# EAGLE schematic 612_jetracer (EAGLE 9.2.2)
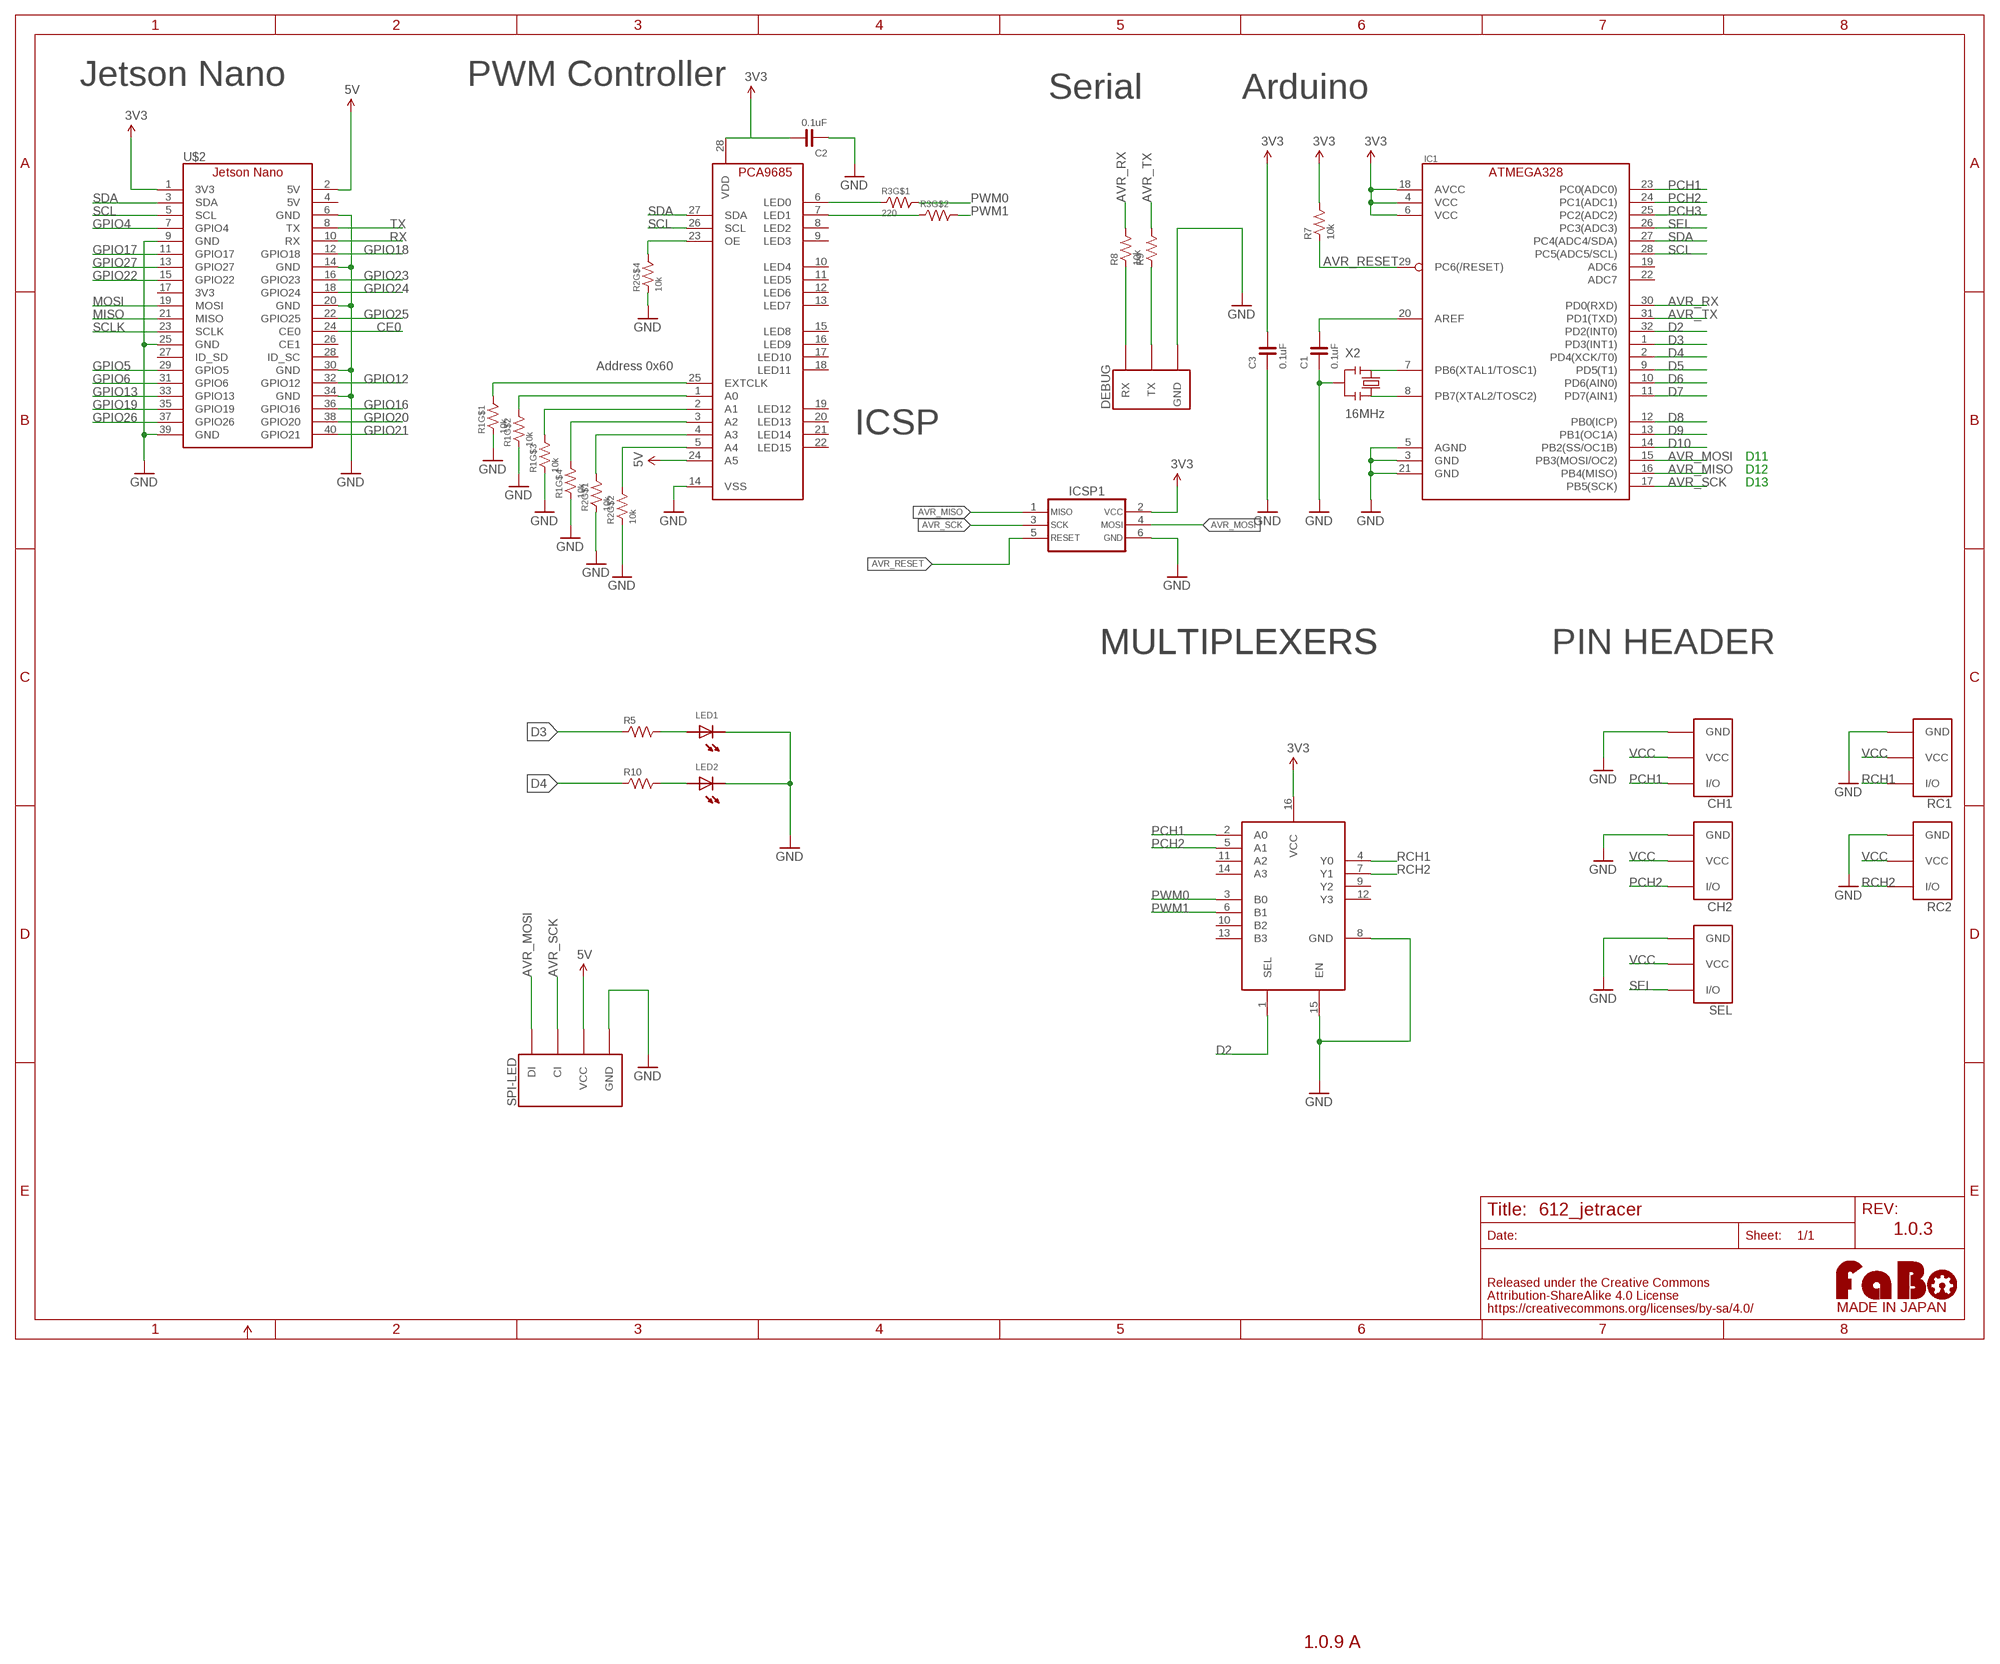
[diagram p0: schematic, sheet 1]

## Parts
C1  0.1uF  CAPACITOR-0603  [0603]
C2  0.1uF  CAPACITOR-0603  [0603]
C3  0.1uF  CAPACITOR-0603  [0603]
CH1  FABO_BRICK_3PIN-HEADER  [FABO_BRICK_3PIN_HEADER]
CH2  FABO_BRICK_3PIN-HEADER  [FABO_BRICK_3PIN_HEADER]
DEBUG  FABO_BRICK_3PIN_DEBUG  [FABO_BRICK_3PIN_DEBUG]
IC1  ATMEGA328P-AU  [TQFP-32]
IC3  MULTIPLEXERSMC74HC157A  [TSSOP-16]
ICSP1  ICSP_AVR-TC_NOHOLE  [TC2030]
LED1  LED-0603  [0603]
LED2  LED-0603  [0603]
R1  10k  RESISTOR_ARRAY  [EXBV8V]
R2  10k  RESISTOR_ARRAY  [EXBV8V]
R3  220  RESISTOR_ARRAY  [EXBV8V]
R5  10k  RESISTOR-0603  [0603]
R7  10k  RESISTOR-0603  [0603]
R8  10k  RESISTOR-0603  [0603]
R9  10k  RESISTOR-0603  [0603]
R10  10k  RESISTOR-0603  [0603]
RC1  FABO_BRICK_3PIN-HEADER  [FABO_BRICK_3PIN_HEADER]
RC2  FABO_BRICK_3PIN-HEADER  [FABO_BRICK_3PIN_HEADER]
SEL  FABO_BRICK_3PIN-HEADER  [FABO_BRICK_3PIN_HEADER]
SPI-LED  FABO-SPI-LED-B04B  [SPI-B04B-PASK-1]
U$2  JETSON_NANO_NOBORDER  [JETSON_NANO_NOBOARDER]
U$9  PCA9685  [PCA9685]
U$14  LOGO_FABO-M  [LOGO_FABO_MS]
X2  16MHz  RESONATOR  [CSTNE_V_C]

## Nets
3V3: C2.2 C3.2 IC1.4(VCC) IC1.6(VCC) IC1.18(AVCC) IC3.16(VCC) ICSP1.2 R7.2 U$2.1(3V3) U$9.28(VDD)
5V: SPI-LED.VCC U$2.2(5V) U$9.24(A5)
AVR_MISO: IC1.16(PB4(MISO)) ICSP1.1
AVR_MOSI: IC1.15(PB3(MOSI/OC2)) ICSP1.4 SPI-LED.DI
AVR_RESET: IC1.29(PC6(/RESET)) ICSP1.5 R7.1
AVR_RX: IC1.30(PD0(RXD)) R8.2
AVR_SCK: IC1.17(PB5(SCK)) ICSP1.3 SPI-LED.CI
AVR_TX: IC1.31(PD1(TXD)) R9.2
CE0: U$2.24(CE0)
D2: IC1.32(PD2(INT0)) IC3.1(SEL)
D3: IC1.1(PD3(INT1)) R5.1
D4: IC1.2(PD4(XCK/T0)) R10.1
D5: IC1.9(PD5(T1))
D6: IC1.10(PD6(AIN0))
D7: IC1.11(PD7(AIN1))
D8: IC1.12(PB0(ICP))
D9: IC1.13(PB1(OC1A))
D10: IC1.14(PB2(SS/OC1B))
GND: C1.1 C2.1 C3.1 CH1.GND CH2.GND DEBUG.GND IC1.3(GND) IC1.5(AGND) IC1.21(GND) IC3.8(GND) IC3.15(EN) ICSP1.6 LED1.CATHODE LED2.CATHODE R1.1 R1.2 R1.3 R1.4 R2.1 R2.2 R2.4 RC1.GND RC2.GND SEL.GND SPI-LED.GND U$2.6(GND) U$2.9(GND) U$2.14(GND) U$2.20(GND) U$2.25(GND) U$2.30(GND) U$2.34(GND) U$2.39(GND) U$9.14(VSS) X2.2
GPIO4: U$2.7(GPIO4)
GPIO5: U$2.29(GPIO5)
GPIO6: U$2.31(GPIO6)
GPIO12: U$2.32(GPIO12)
GPIO13: U$2.33(GPIO13)
GPIO16: U$2.36(GPIO16)
GPIO17: U$2.11(GPIO17)
GPIO18: U$2.12(GPIO18)
GPIO19: U$2.35(GPIO19)
GPIO20: U$2.38(GPIO20)
GPIO21: U$2.40(GPIO21)
GPIO22: U$2.15(GPIO22)
GPIO23: U$2.16(GPIO23)
GPIO24: U$2.18(GPIO24)
GPIO25: U$2.22(GPIO25)
GPIO26: U$2.37(GPIO26)
GPIO27: U$2.13(GPIO27)
MISO: U$2.21(MISO)
MOSI: U$2.19(MOSI)
N$2: R3.1 U$9.6(LED0)
N$3: R3.2 U$9.7(LED1)
N$4: C1.2 IC1.20(AREF)
N$5: IC1.8(PB7(XTAL2/TOSC2)) X2.3
N$6: DEBUG.RX R8.1
N$7: R2.5 U$9.23(OE)
N$8: R1.8 U$9.25(EXTCLK)
N$9: R1.7 U$9.1(A0)
N$10: R1.6 U$9.2(A1)
N$11: R1.5 U$9.3(A2)
N$12: R2.8 U$9.4(A3)
N$13: R2.7 U$9.5(A4)
N$15: IC1.7(PB6(XTAL1/TOSC1)) X2.1
N$17: DEBUG.TX R9.1
N$19: LED1.ANODE R5.2
N$20: LED2.ANODE R10.2
PCH1: CH1.I/O IC1.23(PC0(ADC0)) IC3.2(A0)
PCH2: CH2.I/O IC1.24(PC1(ADC1)) IC3.5(A1)
PCH3: IC1.25(PC2(ADC2))
PWM0: IC3.3(B0) R3.8
PWM1: IC3.6(B1) R3.7
RCH1: IC3.4(Y0) RC1.I/O
RCH2: IC3.7(Y1) RC2.I/O
RX: U$2.10(RX)
SCL: IC1.28(PC5(ADC5/SCL)) U$2.5(SCL) U$9.26(SCL)
SCLK: U$2.23(SCLK)
SDA: IC1.27(PC4(ADC4/SDA)) U$2.3(SDA) U$9.27(SDA)
SEL: IC1.26(PC3(ADC3)) SEL.I/O
TX: U$2.8(TX)
VCC: CH1.VCC CH2.VCC RC1.VCC RC2.VCC SEL.VCC
Unconnected: IC1.19(ADC6) IC1.22(ADC7) IC3.9(Y2) IC3.10(B2) IC3.11(A2) IC3.12(Y3) IC3.13(B3) IC3.14(A3) R2.3 R2.6 R3.3 R3.4 R3.5 R3.6 U$2.4(5V) U$2.17(3V3) U$2.26(CE1) U$2.27(ID_SD) U$2.28(ID_SC) U$9.8(LED2) U$9.9(LED3) U$9.10(LED4) U$9.11(LED5) U$9.12(LED6) U$9.13(LED7) U$9.15(LED8) U$9.16(LED9) U$9.17(LED10) U$9.18(LED11) U$9.19(LED12) U$9.20(LED13) U$9.21(LED14) U$9.22(LED15)

## Notes on the sheet
- Jetson Nano | PWM Controller
- Serial | Arduino
- Address 0x60
- ICSP
- D11
- D12
- D13
- MULTIPLEXERS | MULTIPLEXERS | PIN HEADER
- 1.0.3
- 1.0.9 A

## Library data of the parts
C1-C3 = FaBo-Capacitor:CAPACITOR: CAPACITOR
CH1 CH2 RC1 RC2 SEL = FaBo-Template:FABO_BRICK_3PIN: FaBo Brick 3pin
DEBUG = FaBo-Template:FABO_BRICK_3PIN_DEBUG
IC1 = component:ATMEGA328
IC3 = FaBo-Multiplexers:MULTIPLEXERS
ICSP1 = component:ICSP_AVR
LED1 LED2 = FaBo-LED:LED
R1-R3 = component:RESISTOR_ARRAY
R5 R7-R10 = FaBo-Resistors:RESISTOR: RESISTOR
SPI-LED = FaBo-Connetor:FABO-SPI-LED
U$2 = FaBo-Boards:JETSON_NANO
U$9 = FaBo-Motor:PCA9685
U$14 = FaBo-etc:LOGO_FABO
X2 = component:RESONATOR